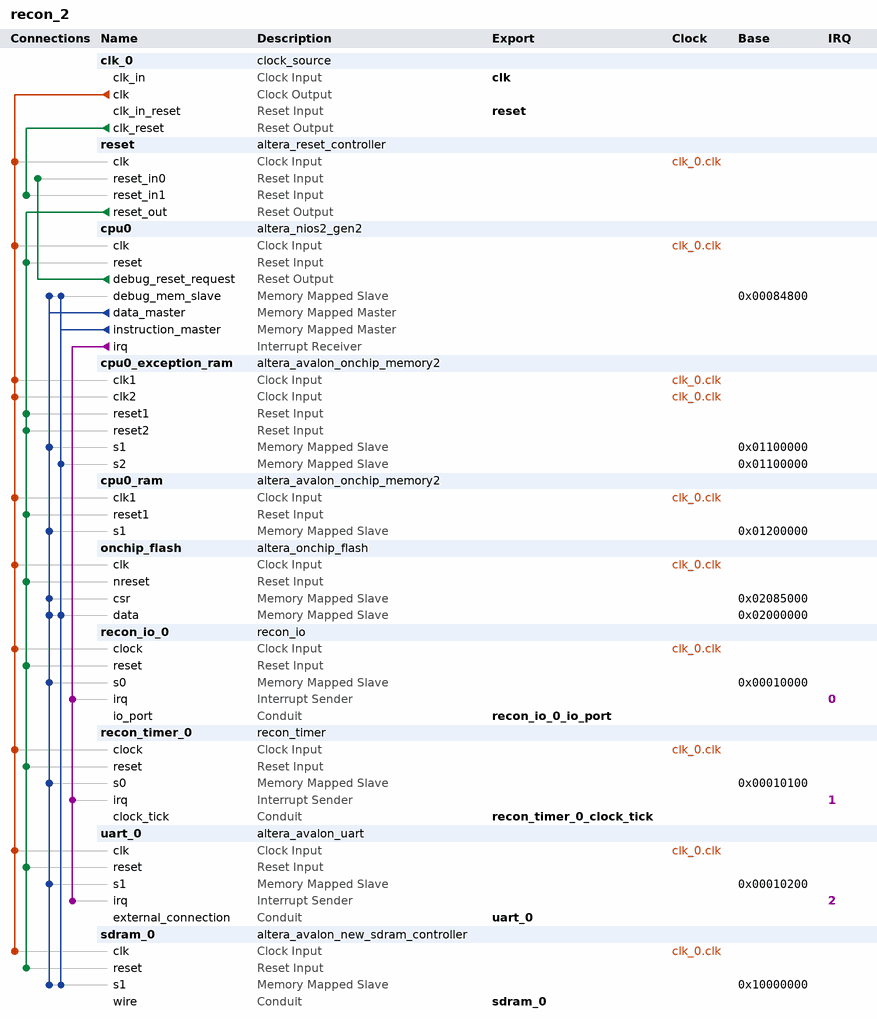
[diagram p0: system contents]
# Platform Designer (Qsys) system recon_2, MAX 10 10M08SAU169C8G
# Parameters at their usual value, and those the tool derives, are not listed.
package require -exact qsys 18.0
create_system recon_2
set_project_property DEVICE_FAMILY {MAX 10}
set_project_property DEVICE 10M08SAU169C8G

add_instance clk_0 clock_source 18.0
set_instance_parameter_value clk_0 clockFrequency 50000000
set_instance_parameter_value clk_0 resetSynchronousEdges DEASSERT

add_instance reset altera_reset_controller 18.0
set_instance_parameter_value reset NUM_RESET_INPUTS 2
set_instance_parameter_value reset SYNC_DEPTH 2

add_instance cpu0 altera_nios2_gen2 18.0
set_instance_parameter_value cpu0 dcache_size 2048
set_instance_parameter_value cpu0 exceptionSlave cpu0_exception_ram.s2
set_instance_parameter_value cpu0 icache_size 1024
set_instance_parameter_value cpu0 impl Tiny
set_instance_parameter_value cpu0 resetSlave onchip_flash.data

add_instance cpu0_exception_ram altera_avalon_onchip_memory2 18.0
set_instance_parameter_value cpu0_exception_ram dataWidth 32
set_instance_parameter_value cpu0_exception_ram dualPort true
set_instance_parameter_value cpu0_exception_ram initMemContent false
set_instance_parameter_value cpu0_exception_ram initializationFileName onchip_mem.hex
set_instance_parameter_value cpu0_exception_ram memorySize 4096

add_instance cpu0_ram altera_avalon_onchip_memory2 18.0
set_instance_parameter_value cpu0_ram dataWidth 32
set_instance_parameter_value cpu0_ram dualPort false
set_instance_parameter_value cpu0_ram initMemContent false
set_instance_parameter_value cpu0_ram initializationFileName onchip_mem.hex
set_instance_parameter_value cpu0_ram memorySize 1000

add_instance onchip_flash altera_onchip_flash 18.0
set_instance_parameter_value onchip_flash CLOCK_FREQUENCY 80.0
set_instance_parameter_value onchip_flash CONFIGURATION_MODE {Single Compressed Image}
set_instance_parameter_value onchip_flash SECTOR_ACCESS_MODE {Read and write,Read and write,Read only,Read only,Hidden}
set_instance_parameter_value onchip_flash initFlashContent false
set_instance_parameter_value onchip_flash initializationFileName altera_onchip_flash.hex
set_instance_parameter_value onchip_flash useNonDefaultInitFile false

add_instance recon_io_0 recon_io 1.0
set_instance_parameter_value recon_io_0 PORT_WIDTH 32
set_instance_parameter_value recon_io_0 PWM_CNTR_WIDTH 12

add_instance recon_timer_0 recon_timer 1.0
set_instance_parameter_value recon_timer_0 CLK_FREQ 50000000

add_instance uart_0 altera_avalon_uart 18.0
set_instance_parameter_value uart_0 baud 115200
set_instance_parameter_value uart_0 dataBits 8
set_instance_parameter_value uart_0 fixedBaud false
set_instance_parameter_value uart_0 parity NONE
set_instance_parameter_value uart_0 stopBits 1

add_instance sdram_0 altera_avalon_new_sdram_controller 18.0
set_instance_parameter_value sdram_0 TAC 5.5
set_instance_parameter_value sdram_0 TRCD 15.0
set_instance_parameter_value sdram_0 TRP 15.0
set_instance_parameter_value sdram_0 casLatency 2
set_instance_parameter_value sdram_0 columnWidth 8
set_instance_parameter_value sdram_0 dataWidth 16
set_instance_parameter_value sdram_0 generateSimulationModel false
set_instance_parameter_value sdram_0 model single_Micron_MT48LC4M32B2_7_chip
set_instance_parameter_value sdram_0 numberOfBanks 4
set_instance_parameter_value sdram_0 numberOfChipSelects 1
set_instance_parameter_value sdram_0 powerUpDelay 200.0
set_instance_parameter_value sdram_0 refreshPeriod 15.625
set_instance_parameter_value sdram_0 rowWidth 12

# connections
add_connection clk_0.clk cpu0.clk clock
add_connection clk_0.clk cpu0_exception_ram.clk1 clock
add_connection clk_0.clk cpu0_exception_ram.clk2 clock
add_connection clk_0.clk cpu0_ram.clk1 clock
add_connection clk_0.clk onchip_flash.clk clock
add_connection clk_0.clk recon_io_0.clock clock
add_connection clk_0.clk recon_timer_0.clock clock
add_connection clk_0.clk reset.clk clock
add_connection clk_0.clk sdram_0.clk clock
add_connection clk_0.clk uart_0.clk clock
add_connection clk_0.clk_reset reset.reset_in1 reset
add_connection cpu0.debug_reset_request reset.reset_in0 reset
add_connection reset.reset_out cpu0.reset reset
add_connection reset.reset_out cpu0_exception_ram.reset1 reset
add_connection reset.reset_out cpu0_exception_ram.reset2 reset
add_connection reset.reset_out cpu0_ram.reset1 reset
add_connection reset.reset_out onchip_flash.nreset reset
add_connection reset.reset_out recon_io_0.reset reset
add_connection reset.reset_out recon_timer_0.reset reset
add_connection reset.reset_out sdram_0.reset reset
add_connection reset.reset_out uart_0.reset reset
add_connection cpu0.data_master cpu0.debug_mem_slave avalon
set_connection_parameter_value cpu0.data_master/cpu0.debug_mem_slave baseAddress 0x00084800
add_connection cpu0.data_master cpu0_exception_ram.s1 avalon
set_connection_parameter_value cpu0.data_master/cpu0_exception_ram.s1 baseAddress 0x01100000
add_connection cpu0.data_master cpu0_ram.s1 avalon
set_connection_parameter_value cpu0.data_master/cpu0_ram.s1 baseAddress 0x01200000
add_connection cpu0.data_master onchip_flash.csr avalon
set_connection_parameter_value cpu0.data_master/onchip_flash.csr baseAddress 0x02085000
add_connection cpu0.data_master onchip_flash.data avalon
set_connection_parameter_value cpu0.data_master/onchip_flash.data baseAddress 0x02000000
add_connection cpu0.data_master recon_io_0.s0 avalon
set_connection_parameter_value cpu0.data_master/recon_io_0.s0 baseAddress 0x00010000
add_connection cpu0.data_master recon_timer_0.s0 avalon
set_connection_parameter_value cpu0.data_master/recon_timer_0.s0 baseAddress 0x00010100
add_connection cpu0.data_master sdram_0.s1 avalon
set_connection_parameter_value cpu0.data_master/sdram_0.s1 baseAddress 0x10000000
add_connection cpu0.data_master uart_0.s1 avalon
set_connection_parameter_value cpu0.data_master/uart_0.s1 baseAddress 0x00010200
add_connection cpu0.instruction_master cpu0.debug_mem_slave avalon
set_connection_parameter_value cpu0.instruction_master/cpu0.debug_mem_slave baseAddress 0x00084800
add_connection cpu0.instruction_master cpu0_exception_ram.s2 avalon
set_connection_parameter_value cpu0.instruction_master/cpu0_exception_ram.s2 baseAddress 0x01100000
add_connection cpu0.instruction_master onchip_flash.data avalon
set_connection_parameter_value cpu0.instruction_master/onchip_flash.data baseAddress 0x02000000
add_connection cpu0.instruction_master sdram_0.s1 avalon
set_connection_parameter_value cpu0.instruction_master/sdram_0.s1 baseAddress 0x10000000
add_connection cpu0.irq recon_io_0.irq interrupt
set_connection_parameter_value cpu0.irq/recon_io_0.irq irqNumber 0
add_connection cpu0.irq recon_timer_0.irq interrupt
set_connection_parameter_value cpu0.irq/recon_timer_0.irq irqNumber 1
add_connection cpu0.irq uart_0.irq interrupt
set_connection_parameter_value cpu0.irq/uart_0.irq irqNumber 2

# exported interfaces
add_interface clk clock sink
set_interface_property clk EXPORT_OF clk_0.clk_in
add_interface recon_io_0_io_port conduit end
set_interface_property recon_io_0_io_port EXPORT_OF recon_io_0.io_port
add_interface recon_timer_0_clock_tick conduit end
set_interface_property recon_timer_0_clock_tick EXPORT_OF recon_timer_0.clock_tick
add_interface reset reset sink
set_interface_property reset EXPORT_OF clk_0.clk_in_reset
add_interface sdram_0 conduit end
set_interface_property sdram_0 EXPORT_OF sdram_0.wire
add_interface uart_0 conduit end
set_interface_property uart_0 EXPORT_OF uart_0.external_connection

set_interconnect_requirement {$system} qsys_mm.clockCrossingAdapter HANDSHAKE
set_interconnect_requirement {$system} qsys_mm.enableEccProtection FALSE
set_interconnect_requirement {$system} qsys_mm.insertDefaultSlave FALSE
set_interconnect_requirement {$system} qsys_mm.maxAdditionalLatency 1

save_system recon_2.qsys
